# EAGLE design Adafruit LPS35HW (EAGLE 9.4.0)
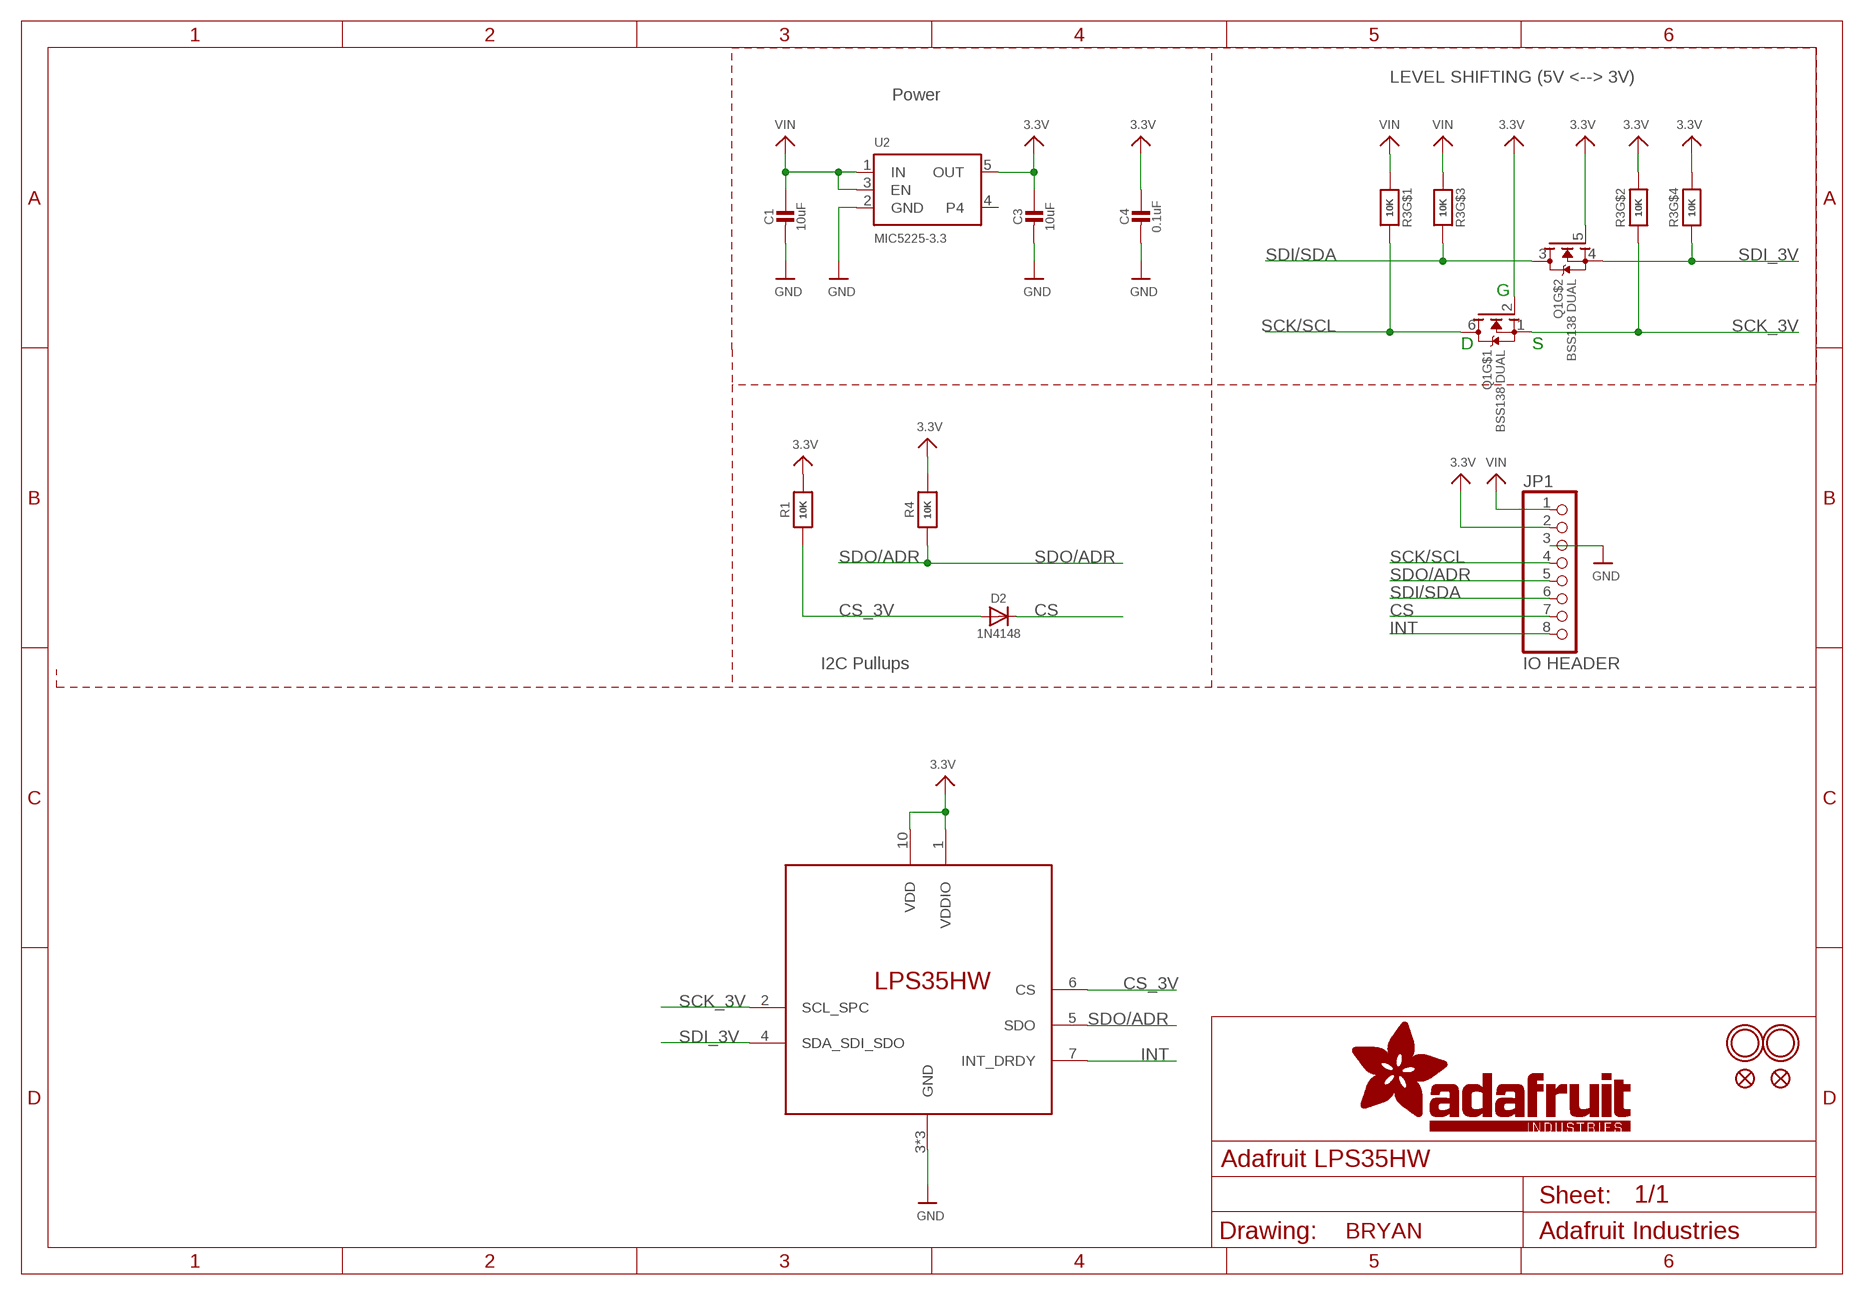
[diagram p0: schematic, sheet 1]
U$1 (FRAME_A4_ADAFRUIT): AUTHOR: BRYAN

## Parts
C1  10uF  CAP_CERAMIC0805-NOOUTLINE  [0805-NO]
C3  10uF  CAP_CERAMIC0805-NOOUTLINE  [0805-NO]
C4  0.1uF  CAP_CERAMIC0603_NO  [0603-NO]
D2  1N4148  DIODESOD-323  [SOD-323]
JP1  IO HEADER  HEADER-1X8ROUND  [1X08_ROUND]
Q1  BSS138 DUAL  MOSFET-N_DUAL  [SOT363]
R1  10K  RESISTOR_0603_NOOUT  [0603-NO]
R3  10K  RESISTOR_4PACK  [RESPACK_4X0603]
R4  10K  RESISTOR_0603_NOOUT  [0603-NO]
U2  MIC5225-3.3  VREG_SOT23-5  [SOT23-5]
U$3  LPS35HWLPS35HW  [CCLGA10L]
U$5  FIDUCIAL_1MM  [FIDUCIAL_1MM]
U$7  MOUNTINGHOLE2.0  [MOUNTINGHOLE_2.0_PLATED]
U$8  MOUNTINGHOLE2.0  [MOUNTINGHOLE_2.0_PLATED]
U$15  FIDUCIAL_1MM  [FIDUCIAL_1MM]

## Nets
3.3V: C3.1 C4.1 JP1.2 Q1.2(G) Q1.5(G) R1.2 R3.2 R3.4 R4.2 U2.5(OUT) U$3.1(VDDIO) U$3.10(VDD)
CS: D2.C JP1.7
CS_3V: D2.A R1.1 U$3.6(CS)
GND: C1.2 C3.2 C4.2 JP1.3 U2.2(GND) U$3.3(GND) U$3.8(GND) U$3.9(GND)
INT: JP1.8 U$3.7(INT_DRDY)
SCK/SCL: JP1.4 Q1.6(D) R3.8
SCK_3V: Q1.1(S) R3.7 U$3.2(SCL_SPC)
SDI/SDA: JP1.6 Q1.3(D) R3.6
SDI_3V: Q1.4(S) R3.5 U$3.4(SDA_SDI_SDO)
SDO/ADR: JP1.5 R4.1 U$3.5(SDO)
VIN: C1.1 JP1.1 R3.1 R3.3 U2.1(IN) U2.3(EN)
Unconnected: U2.4

## Notes on the sheet
- LEVEL SHIFTING (5V <--> 3V)
- Power
- G
- D | S
- I2C Pullups

## Library data of the parts
C1 C3 C4 = microbuilder:CAP_CERAMIC: Ceramic Capacitors For new designs, use the packages preceded by an '_' character since they are more reliable: The following footprints should be used on most boards: _0402 - Standard footprint for regular board layouts _0603 - Standard footprint for regular board layouts _0805 - Standard footprint for regular board layouts _1206 - Standard footprint for regular board layouts For extremely tight-pitch boards where space is at a premium, the following 'micro-pitch' footprints can be used (smaller pads, no silkscreen outline, etc.): _0402MP - Micro-pitch footprint for very dense/compact boards _0603MP - Micro-pitch footprint for very dense/compact boards _0805MP - Micro-pitch footprint for very dense/compact boards _1206MP - Micro-pitch footprint for very dense/compact boards
D2 = microbuilder:DIODE: Diode SMA Model Volts Amps Type Vf Ir Digikey # Notes SSA34-E3 40V 3A Schottky 480mV @ 3A 200uA @ 40V SSA34-E3/61TGITR-ND CDBA120-G 20V 1A Schottky 500mV @ 1A 500uA @ 20V 641-1014-6-ND REEL MBRA210 10V 2A Schottky 350mV @ 2A 700uA @ 10V MBRA210LT3 SOD-123 Model Volts Amps Type Vf Ir Order # Notes BAT54T1G 30V 200mA Schottky 800mV @ 200mA 2uA @ 25V BAT54T1GOSTR-ND B0530W 30V 500mA Schottky 430mV @ 500mA 130uA @ 30V B0530W-FDICT-ND REEL MBR120 20V 1A Schottky 340mV @ 1A MBR120VLSFT1GOSCT-ND SOD-323 Model Volts Amps Type Vf Ir Order # Notes PMEG2005EJ 20V 500mA Schottky 355mV @ 500mA 568-4110-1-ND ZLLS410 10V 570mA Schottky 380mV @ 570mA ZLLS410CT-ND 1N4148WS 75V 150mA Silicon/Simple 1V 1N4148WSFSCT-ND REEL SOD-523 Model Volts Amps Type Vf Ir Order # Notes BAT54XV2 30V 200mA Schottky 0.8V @ 100mA BAT54XV2CT-ND TB751S 30V 30mA Schottky RB751S-40TE61CT-ND SOT23-R/W (R = Solder Paste/Reflow Ovens, W = Hand-Soldering) Model Volts Amps Type Vf Ir Order # Notes BAT54FILM 40V 300mA Schottky 497-7162-1-ND POWERDI-5 Model Volts Amps Type Vf Ir Order # Notes PDS560 60V 5A Schottky 670mV @ 5A 150uA @ 60V PDS560DICT-ND
JP1 = microbuilder:HEADER-1X8: PIN HEADER
Q1 = microbuilder:MOSFET-N_DUAL: Dual N-Channel MOSFET SOT363 (2.0x1.25mm) 2N7002PS - 60V, 320mA [Digikey: 568-5984-1-ND]
R1 R4 = microbuilder:RESISTOR: Resistors For new designs, use the packages preceded by an '_' character since they are more reliable: The following footprints should be used on most boards: _0402 - Standard footprint for regular board layouts _0603 - Standard footprint for regular board layouts _0805 - Standard footprint for regular board layouts _1206 - Standard footprint for regular board layouts For extremely tight-pitch boards where space is at a premium, the following 'micro-pitch' footprints can be used (smaller pads, no silkscreen outline, etc.): _0402MP - Micro-pitch footprint for very dense/compact boards _0603MP - Micro-pitch footprint for very dense/compact boards _0805MP - Micro-pitch footprint for very dense/compact boards _1206MP - Micro-pitch footprint for very dense/compact boards
R3 = microbuilder:RESISTOR_4PACK: Resistor Packs (4 resistors) 4 x 0603 10K 1/16W - Digikey: YC164J-10KCT-ND
U2 = microbuilder:VREG_SOT23-5: SOT23-5 Fixed Voltage Regulators Part Current Out V Out V In V Dropout θJA (°C/W) TJ (°C) Digikey Part No. ADP121 150mA 3.3V 3.4-5.5V 0.09V @ 150mA -- -- ADP121-AUJZ33R7CT-ND ADP121 150mA 3.0V 3.1-5.5V 0.09V @ 150mA -- -- ADP121-AUJZ30R7CT-ND ADP122 300mA 3.3V 3.4-5.5V 0.085V @ 300mA -- -- ADP122AUJZ-3.3-R7CT-ND ADP1712 300mA 3.3V 3.5-5.5V 0.17V @ 300mA -- -- ADP1712AUJZ-3.3-R7TR-ND AP7311 (Low Cost) 150mA 3.3V 3.5-6V 0.15V @ 150mA -- -- AP7311-33WG-7DICT-ND LD39015M18R 150mA 1.8V 1.9V-5.5V 0.08V @ 100mA -- -- 497-6977-1-ND LP2985A-33DBVR 150mA 3.3V 3.3-16V 0.28V @ 150mA 206 150 296-18479-1-ND MCP1824T-3302E/OT 300mA 3.3V 3.5V-6V 0.2V @ 300mA -- -- MCP1824T-3302E/OTCT-ND MIC5205-2.5YM5 TR 150mA 2.5V 2.7-16V 0.165V @ 150mA -- -- 576-1257-2-ND MIC5205-3.0YM5 TR 150mA 3.0V 3.2V-16V 0.165V @ 150mA -- -- 576-1258-2-ND MIC5205-3.3YM5 TR 150mA 3.3V 3.5V-16V 0.165V @ 150mA -- -- 576-1259-2-ND TPS780330220 150mA 3.3V+2.2V 3.6-5.5V 250mV Max -- -- 296-23332-1-ND TDA3663/N1,135 100mA 3.3V 3.5-45V 0.18V @ 50mA -- -- 568-5343-1-ND Max operating temp can be calculated using θJA, TJ (max junction temperature), and power in watts. Set the "Maximum Ambient Temperature" until it reaches TJ ("Max Junction Temperature"), which is the absolute limit for safe use of the regulator: Heat Sink Temperature Calculator <http://www.daycounter.com/Calculators/Heat-Sink-Temperature-Calculator.phtml> For example, With 12V source into a 3.3V LP2985 and a 30mA load, we are dissipating (12V-3.3V) * 0.03A = 0.261W. With a θJA of 206 °C/W, a TJ of 150°C, and 261mW we can safely use the chip without a heat sink up to 75°C (=147.1°C Junction Temperature).
U$3 = microbuilder:LPS35HW: LPS35HW - Water Resistant MEMS Pressure Sensor Digikey Part Number 497-16706-1-ND‎ https://www.st.com/resource/en/datasheet/lps35hw.pdf
U$5 U$15 = microbuilder:FIDUCIAL: Fiducial Alignment Points Various fiducial points for machine vision alignment.; BOM: EXCLUDE
U$7 U$8 = microbuilder:MOUNTINGHOLE: Mounting Hole For #2 screws (0.086"/2.18mm width, 0.094"/2.4mm hole) use 2.5mm; BOM: EXCLUDE

## Board
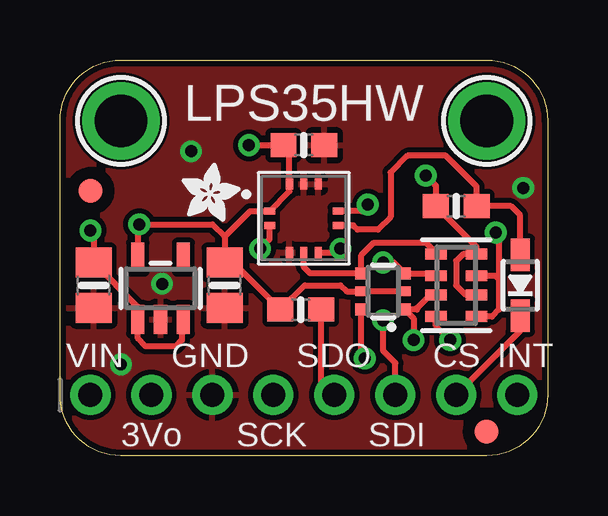
[diagram p1: board, top side]
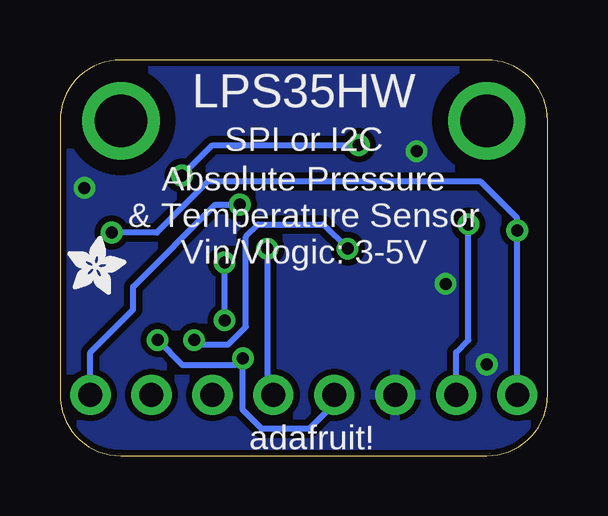
[diagram p2: board, bottom side, seen from below]

Size 20.32 x 16.51 mm. Coordinates in mm from the lower left corner, seen from the top.
Outline: 17.78,0 2.54,0 arc-90 0,2.54 0,13.97 arc-90 2.54,16.51 17.78,16.51 arc-90 20.32,13.97 20.32,2.54 arc-90 17.78,0
Copper layers (1*16): Top 0.035mm / dielectric 1.5mm / Bottom 0.035mm
Design rules "adafruit *": minimum track width 8mil, minimum drill 15.5mil, track to track 8mil, track to pad 8mil, pad to pad 8mil, via to via 8mil, smd to smd 8mil, copper to edge 10mil, drill to drill 8mil, minimum pad ring 10mil, minimum via ring 8mil, stop-mask expansion 2mil, vias tented up to drill 20mil, thermal gap 10mil

### Footprints (pad centres in the part's own frame; a part is rotated, then mirrored left to right if it is on the bottom)
0805-NO = smd 1.24 x 1.5: 1 -0.95,0; 2 0.95,0
0603-NO = smd 1.075 x 1: 1 -0.85,0; 2 0.85,0
SOD-323 = smd 1.35 x 0.8: A 1.27,0; C -1.27,0
1X08_ROUND = drill 1 pad 1.676: 1 -8.89,0; 2 -6.35,0; 3 -3.81,0; 4 -1.27,0; 5 1.27,0; 6 3.81,0; 7 6.35,0; 8 8.89,0
SOT363 = smd 0.5 x 0.5: 1 -0.75,-0.9; 3 0.75,-0.9; 4 0.75,0.9; 6 -0.75,0.9 | smd 0.4 x 0.5: 2 0,-0.9; 5 0,0.9
RESPACK_4X0603 = smd 0.45 x 0.9: 1 -1.3,-0.85; 2 -0.4,-0.85; 3 0.4,-0.85; 4 1.3,-0.85; 5 1.3,0.85; 6 0.4,0.85; 7 -0.4,0.85; 8 -1.3,0.85
SOT23-5 = smd 0.55 x 1.2: 1 -0.95,-1.3; 2 0,-1.3; 3 0.95,-1.3; 4 0.95,1.3; 5 -0.95,1.3
CCLGA10L = smd 0.45 x 0.3: 1 -1.425,0.3; 2 -1.425,-0.3; 6 1.425,-0.3; 7 1.425,0.3 | smd 0.3 x 0.45: 3 -0.6,-1.425; 4 0,-1.425; 5 0.6,-1.425; 8 0.6,1.425; 9 0,1.425; 10 -0.6,1.425
FIDUCIAL_1MM = smd 1 x 1: 1 0,0
MOUNTINGHOLE_2.0_PLATED = drill 2.2 pad 3: P$1 0,0

### Placement (x,y rotation side)
C1  1.4,7.11 270 top
C3  6.86,7.11 270 top
C4  10.16,12.95 0 top
D2  19.18,7.11 90 top
JP1  10.16,2.54 0 top
Q1  13.46,6.86 90 top
R1  16.51,10.41 180 top
R3  16.51,7.11 90 top
R4  10.03,6.1 180 top
U2  4.19,6.99 0 top
U$2  [ADAFRUIT_2.5MM]  20,6.73 0 bottom
U$3  10.16,9.91 0 top
U$5  1.27,11.05 0 top
U$6  [ADAFRUIT_2.5MM]  5.08,9.78 0 top
U$7  2.54,13.97 0 top
U$8  17.78,13.97 0 top
U$15  17.78,1.02 0 top

### Tracks (layer width: path | path; a pad name or v marks a point on that pad's centre or on a via)
3.3V  (via drill 0.5)
  Top 0.254: U2.5 3.24,9.59 v3.3,9.65 6.35,9.65 6.86,9.14 | 6.86,9.14 C3.1 7.22,8.06 R4.2 10.2,7.11 11.68,7.11 11.94,6.86 Q1.5 Q1.2 | 6.86,9.14 7.92,10.21 U$3.1 9.56,11.03 U$3.10 9.56,12.7 C4.1 v7.87,12.95 | R3.2 16.91,6.71 16.51,7.11 16.51,8.13 16.79,8.41 R3.4 17.36,8.71 R1.2 15.66,11.26 v15.24,11.68
  Bottom 0.254: JP1.2 3.81,4.32 3.3,4.83 v3.3,9.65 | v15.24,11.68 13.97,12.95 v7.87,12.95
CS
  Top 0.254: D2.C 19.18,5.21 JP1.7
CS_3V
  Top 0.254: D2.A 19.18,10.03 18.8,10.41 R1.1 17.36,11.23 16.08,12.51 14.48,12.51 13.78,11.81 13.78,9.97 13.24,9.43 12.4,9.43 12.22,9.61 U$3.6
GND  (via drill 0.5)
  other vias: 4.25,7.18 5.46,12.7 19.3,11.18 2.54,3.81
  pour Bottom (isolate 0.254): 0,16.51 20.32,16.51 20.45,0 0,0
  pour Top: 0,16.51 20.32,16.51 20.32,0 0,0
INT  (via drill 0.5)
  Top 0.254: v12.83,10.48 12.56,10.21 U$3.7
  Bottom 0.254: JP1.8 19.05,4.32 17.27,6.1 17.27,7.05 13.84,10.48 v12.83,10.48
SCK/SCL  (via drill 0.5)
  Top 0.254: v12.7,4.06 12.56,4.2 Q1.6 | v16.26,4.83 15.66,5.42 R3.8
  Bottom 0.254: JP1.4 8.89,2.16 9.93,1.12 11.91,1.12 12.72,1.93 12.72,4.04 v12.7,4.06 12.75,4.06 13.03,3.78 15.21,3.78 v16.26,4.83
SCK_3V  (via drill 0.5)
  Top 0.254: R3.7 15.42,6.71 14.88,6.17 14.88,6.1 14.37,6.1 Q1.1 14.73,5.74 v14.73,4.83 | v8.34,8.64 8.73,9.03 U$3.2
  Bottom 0.254: v8.34,8.64 9.35,9.65 12.06,9.65 12.57,9.14 12.57,5.38 13.32,4.64 14.54,4.64 v14.73,4.83
SDI/SDA  (via drill 0.5)
  Top 0.254: R3.6 15.56,7.61 Q1.3 13.9,8.06 v13.46,8.06 | JP1.6 13.97,3.87 13.46,4.38 v13.46,5.65
  Bottom 0.254: v13.46,5.65 v13.46,8.06
SDI_3V
  Top 0.254: U$3.4 10.16,7.87 10.43,7.61 Q1.4 12.56,8.37 13.08,8.89 15.24,8.89 15.66,8.47 R3.5
SDO/ADR  (via drill 0.5)
  Top 0.254: JP1.5 10.88,3.09 R4.1 | U$3.5 11.53,8.48 v11.68,8.64
  Bottom 0.254: v11.68,8.64 11.68,2.79 JP1.5
VIN  (via drill 0.5)
  Top 0.254: v1.27,9.4 1.4,9.27 C1.1 3.24,6.22 U2.1 3.24,4.89 3.56,4.57 4.83,4.57 5.08,4.83 5.08,5.62 U2.3 | R3.3 18.14,7.51 18.29,7.37 | 18.29,7.37 18.29,6.1 18,5.81 R3.1 | v18.16,9.31 18.29,9.18 18.29,7.37
  Bottom 0.254: JP1.1 v1.27,9.4 1.27,9.91 2.79,11.43 14.16,11.43 16.28,9.31 v18.16,9.31

### Text on the board
tPlace: LPS35HW | VIN | GND | SDO | CS | INT | 3Vo | SCK | SDI
bPlace: LPS35HW | SPI or I2C | Absolute Pressure / & Temperature Sensor | Vin/Vlogic: 3-5V | adafruit!